# EAGLE schematic Hookup Schematic (EAGLE 9.1.1)
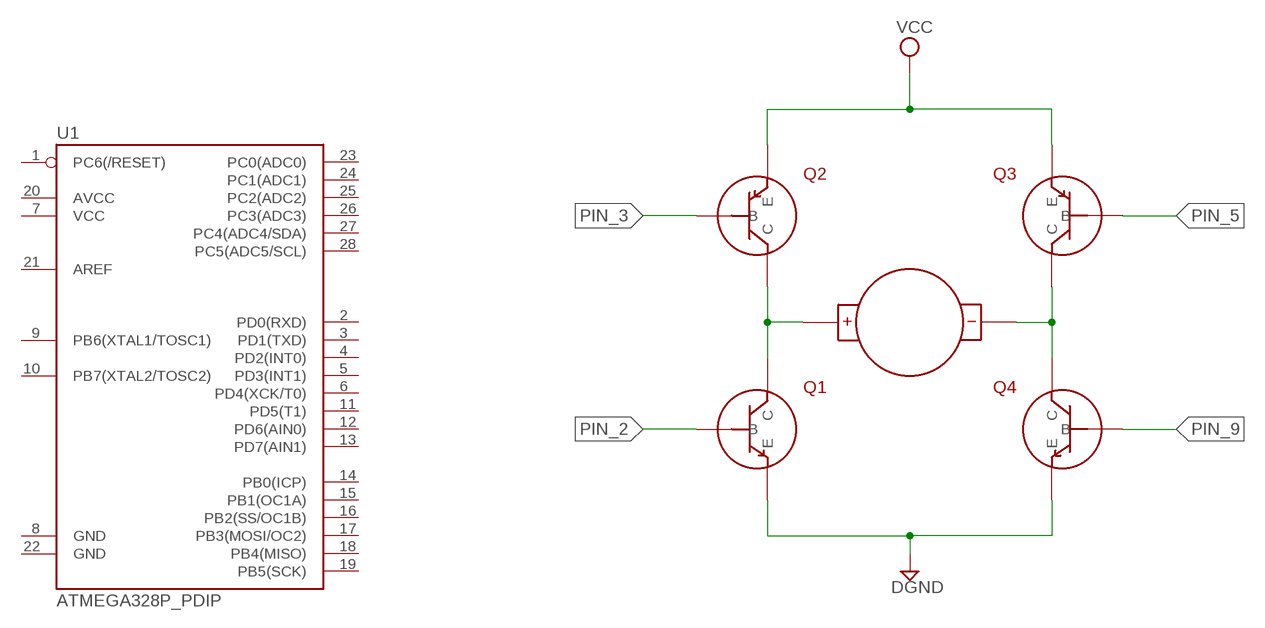
[diagram p0: schematic, sheet 1]

## Parts
Q1  BJT_NPN  (no package)
Q2  BJT_PNP  (no package)
Q3  BJT_PNP  (no package)
Q4  BJT_NPN  (no package)
U1  ATMEGA328P_PDIP  [DIL28-3]
U$1  MOTOR  [MOTOR]

## Nets
DGND: Q1.E Q4.E
MOTOR_NEGATIVE: Q3.C Q4.C U$1.P$2
N$1: Q1.C Q2.C U$1.P$1
PIN_2: Q1.B
PIN_3: Q2.B
PIN_5: Q3.B
PIN_9: Q4.B
VCC: Q2.E Q3.E
Unconnected: U1.1(PC6(/RESET)) U1.2(PD0(RXD)) U1.3(PD1(TXD)) U1.4(PD2(INT0)) U1.5(PD3(INT1)) U1.6(PD4(XCK/T0)) U1.7(VCC) U1.8(GND) U1.9(PB6(XTAL1/TOSC1)) U1.10(PB7(XTAL2/TOSC2)) U1.11(PD5(T1)) U1.12(PD6(AIN0)) U1.13(PD7(AIN1)) U1.14(PB0(ICP)) U1.15(PB1(OC1A)) U1.16(PB2(SS/OC1B)) U1.17(PB3(MOSI/OC2)) U1.18(PB4(MISO)) U1.19(PB5(SCK)) U1.20(AVCC) U1.21(AREF) U1.22(GND) U1.23(PC0(ADC0)) U1.24(PC1(ADC1)) U1.25(PC2(ADC2)) U1.26(PC3(ADC3)) U1.27(PC4(ADC4/SDA)) U1.28(PC5(ADC5/SCL))

## Library data of the parts
Q1 Q4 = ngspice-simulation:BJT_NPN: Bipolar NPN Transistor
Q2 Q3 = ngspice-simulation:BJT_PNP: Bipolar PNP Transistor
U1 = SparkFun-DigitalIC:ATMEGA328P_PDIP: uC used in the Arduino 32kb flash, 1k EEPROM, 2k SRAM This is the through-hole version of this chip.
U$1 = motor:MOTOR